# Altium schematic sheet BDS_NBIOT.SchDoc
size A2
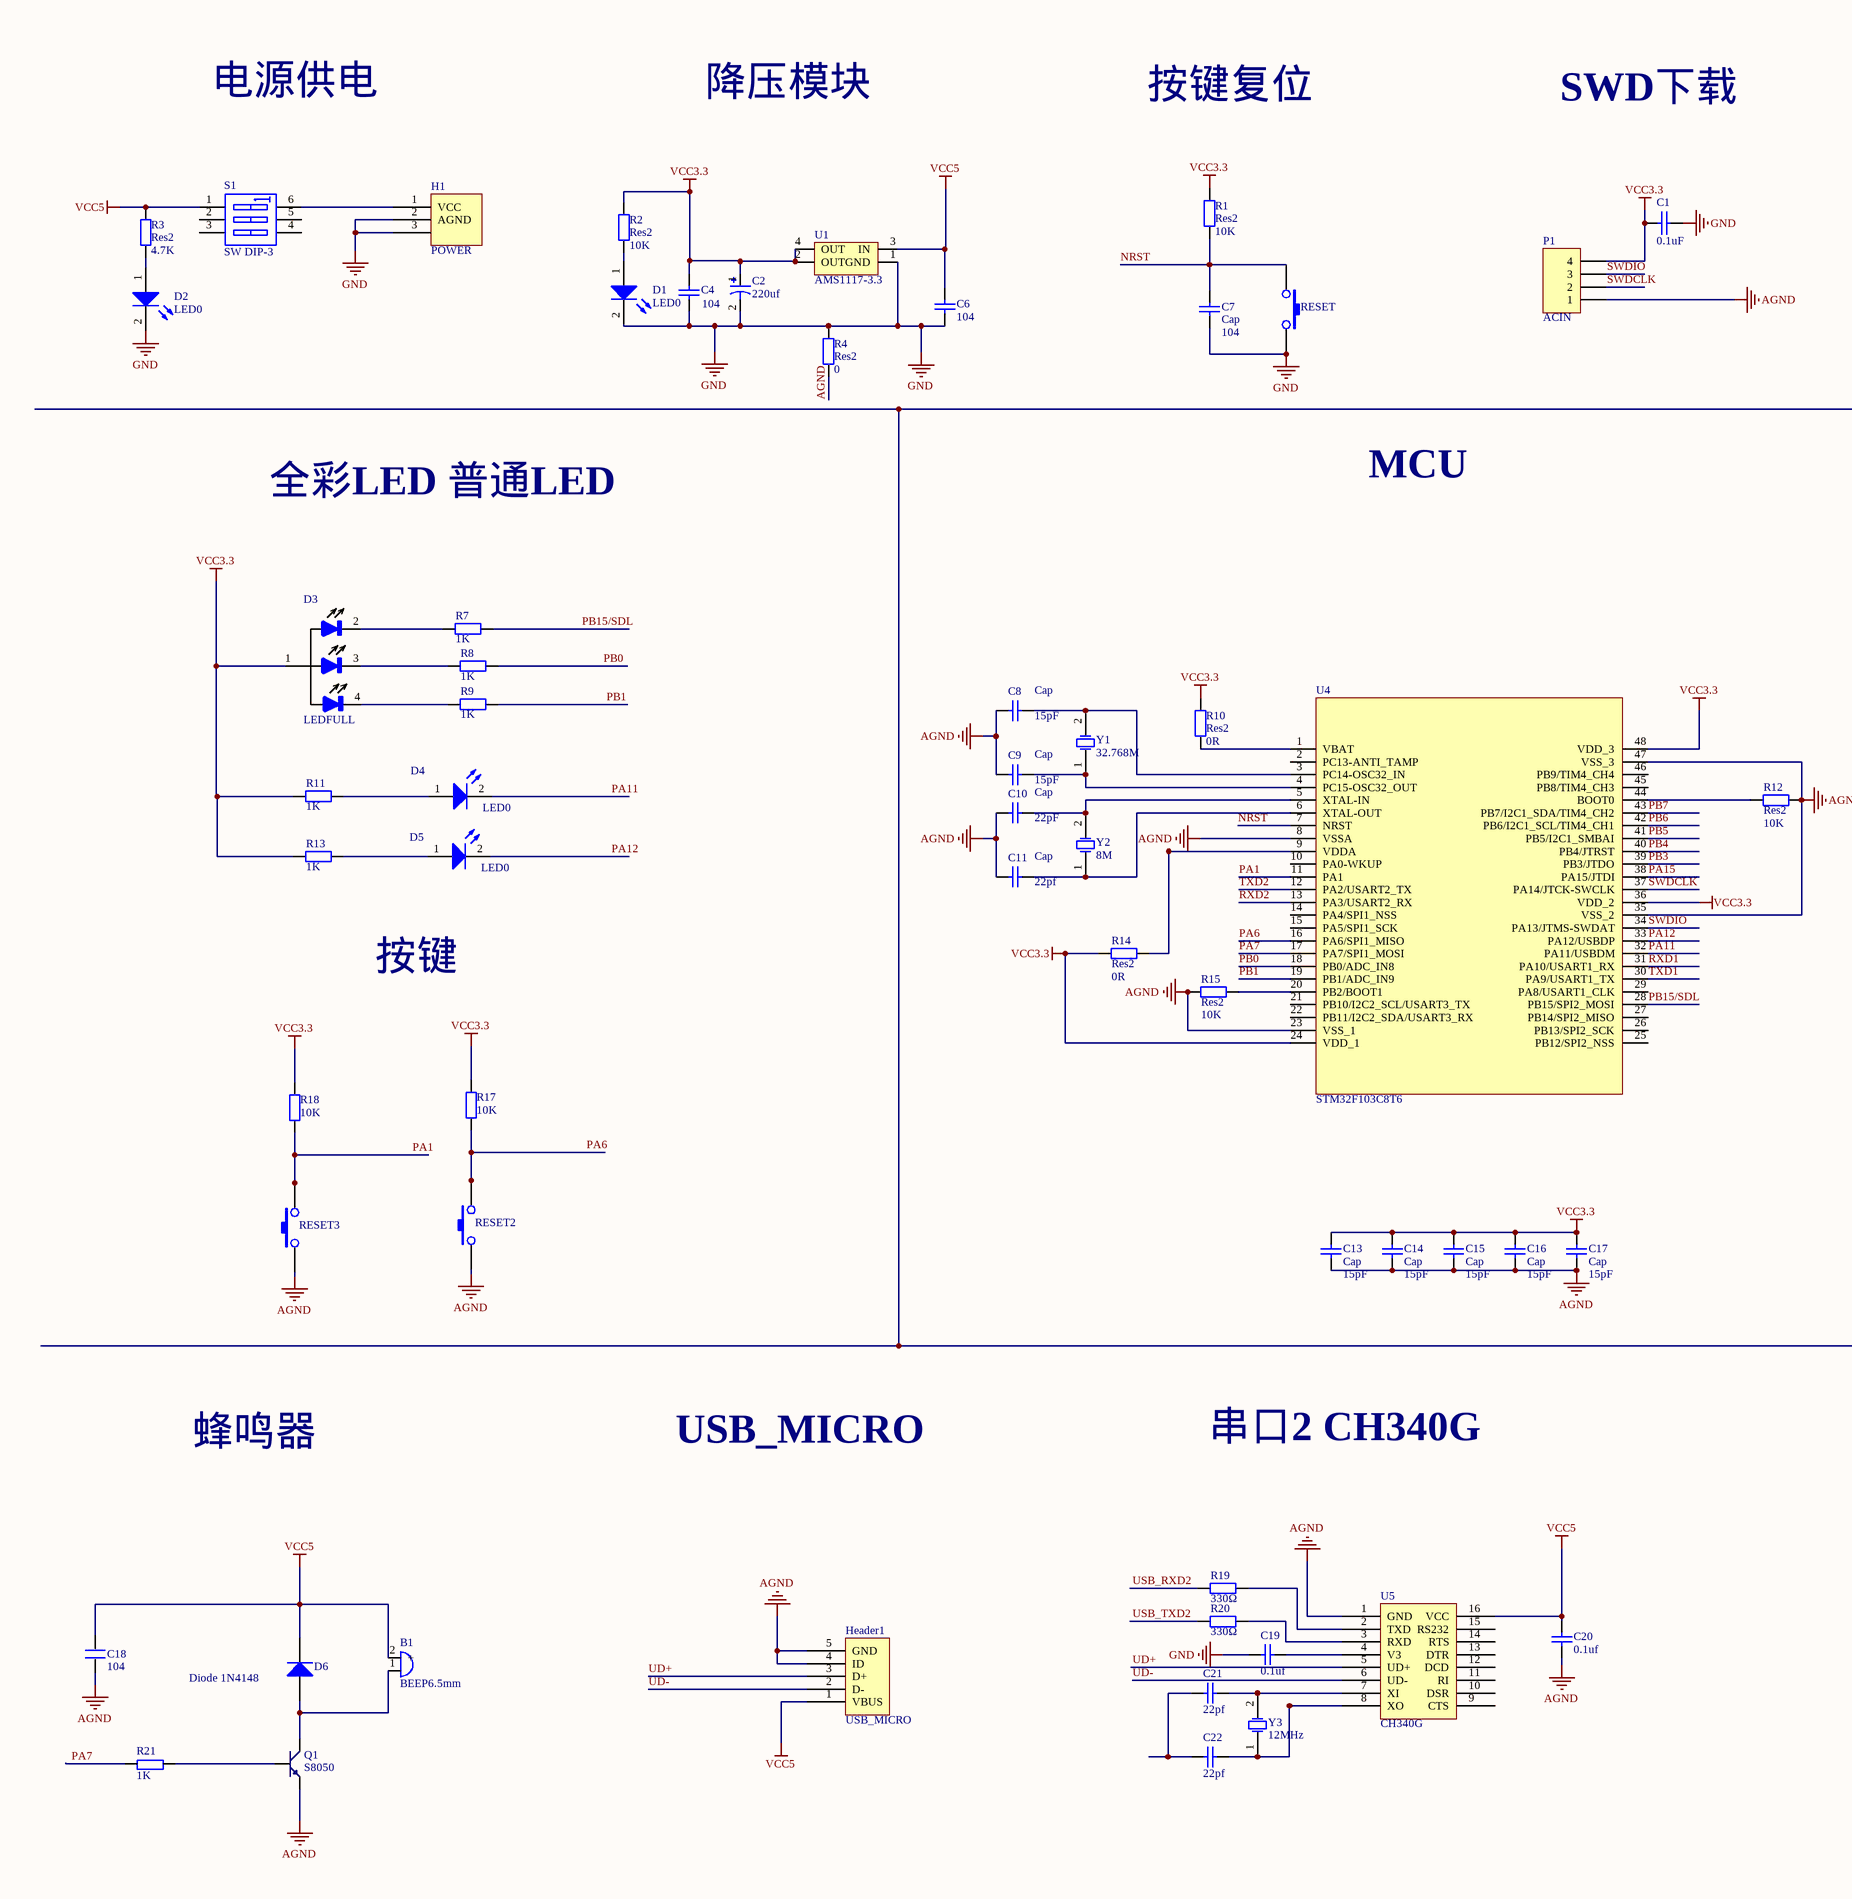
[diagram p0: BDS_NBIOT.SchDoc, left]
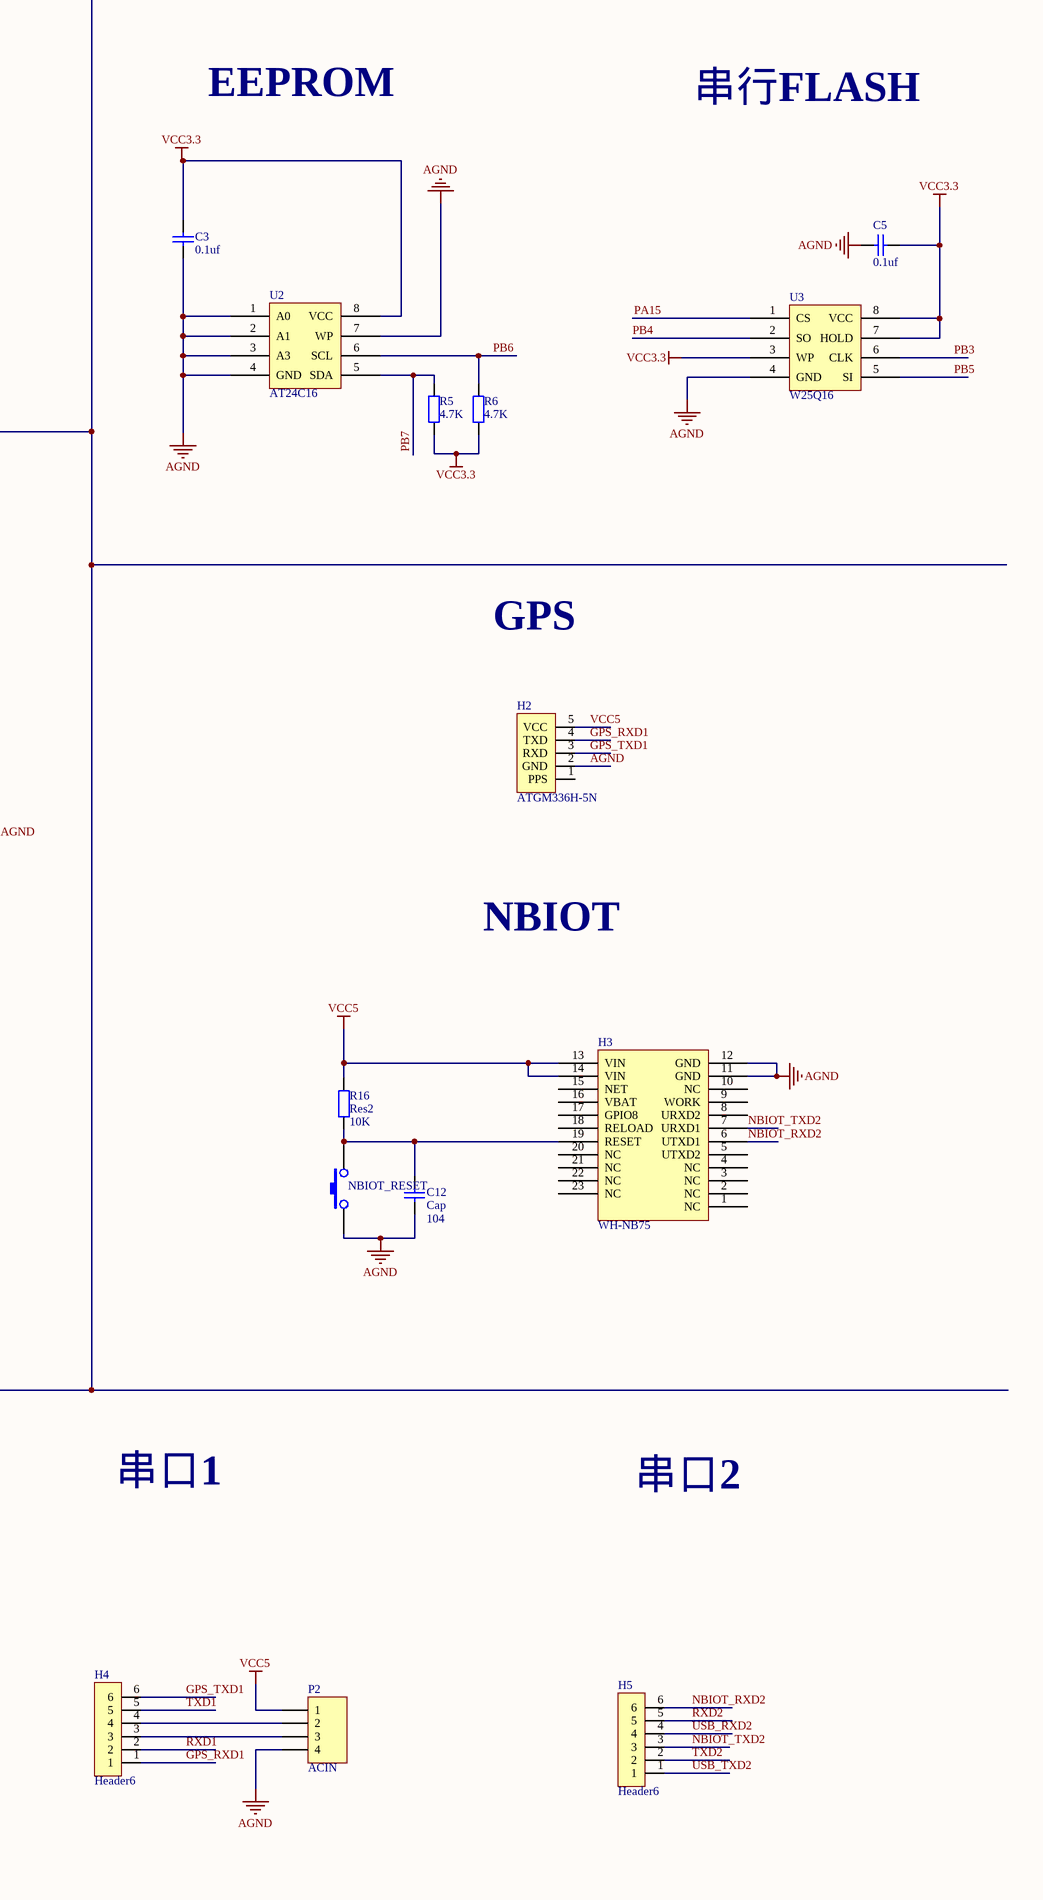
[diagram p1: BDS_NBIOT.SchDoc, right]

## Parts
B1  BEEP6.5mm  [BEEP 6.5x12x6]
C1  0.1uF  [0805C]
C2  220uf  [CAP 2.5*6.3*11.2]
C3  0.1uf  [0805C]
C4  104  [0805C]
C5  0.1uf  [0805C]
C6  104  [0805C]
C7  Cap  value 104  [0805C]
C8  Cap  value 15pF  [0805C]
C9  Cap  value 15pF  [0805C]
C10  Cap  value 22pF  [0805C]
C11  Cap  value 22pf  [0805C]
C12  Cap  value 104  [0805C]
C13  Cap  value 15pF  [0805C]
C14  Cap  value 15pF  [0805C]
C15  Cap  value 15pF  [0805C]
C16  Cap  value 15pF  [0805C]
C17  Cap  value 15pF  [0805C]
C18  104  [0805C]
C19  0.1uf  [0805C]
C20  0.1uf  [0805C]
C21  22pf  [0805C]
C22  22pf  [0805C]
D1  LED0  [0805D]
D2  LED0  [0805D]
D3  LEDFULL  [LEDFULL]
D4  LED0  [0805D]
D5  LED0  [0805D]
D6  Diode 1N4148  [0805D]
H1  POWER  [DC-005]
H2  ATGM336H-5N
H3  WH-NB75  [NBIOT]
H4  Header6  [HDR2.54-LI-6P]
H5  Header6  [HDR2.54-LI-6P]
Header1  USB_MICRO  [USB/SM0.8-6H5]
NBIOT_RESET  RESET  [KEY]  (value not drawn)
P1  ACIN  [HDR2.54-LI-4P]
P2  ACIN  [HDR2.54-LI-4P]
Q1  S8050  [SOT23-3]
R1  Res2  value 10K  [0805R]
R2  Res2  value 10K  [0805R]
R3  Res2  value 4.7K  [0805R]
R4  Res2  value 0  [0805R]
R5  4.7K  [0805R]
R6  4.7K  [0805R]
R7  1K  [0805R]
R8  1K  [0805R]
R9  1K  [0805R]
R10  Res2  value 0R  [0805R]
R11  1K  [0805R]
R12  Res2  value 10K  [0805R]
R13  1K  [0805R]
R14  Res2  value 0R  [0805R]
R15  Res2  value 10K  [0805R]
R16  Res2  value 10K  [0805R]
R17  10K  [0805R]
R18  10K  [0805R]
R19  330Ω  [0805R]
R20  330Ω  [0805R]
R21  1K  [0805R]
RESET  RESET  [KEY]  (value not drawn)
RESET2  RESET  [KEY]  (value not drawn)
RESET3  RESET  [KEY]  (value not drawn)
S1  SW DIP-3  [Switch]
U1  AMS1117-3.3  [AMS1117]
U2  AT24C16  [SOP-8]
U3  W25Q16  [SOP-8]
U4  STM32F103C8T6  [SQFP7X7-48]
U5  CH340G  [SOP16]
Y1  32.768M  [OSC HC-49SMD]
Y2  8M  [OSC HC-49SMD]
Y3  12MHz  [OSC HC-49SMD]

## Nets
AGND: C3.1 C5.1 C8.1 C9.1 C10.1 C11.1 C12.1 C13.1 C14.1 C15.1 C16.1 C17.1 C18.1 C20.1 H2.2(GND) H3.11(GND) H3.12(GND) Header1.4(ID) Header1.5(GND) NBIOT_RESET.1 P1.1 P2.4 Q1.1(E) R4.1 R12.1 R15.2 RESET2.1 RESET3.1 U2.1(A0) U2.2(A1) U2.3(A3) U2.4(GND) U2.7(WP) U3.4(GND) U4.8(VSSA) U4.23(VSS_1) U4.35(VSS_2) U4.47(VSS_3) U5.1(GND)
GND: C1.2 C2.2 C4.1 C6.1 C7.1 C19.2 D1.2(K) D2.2(K) H1.2(AGND) H1.3 R4.2 RESET.2 U1.1(GND)
VCC3.3: C1.1 C2.1 C3.2 C4.2 C5.2 C13.2 C14.2 C15.2 C16.2 C17.2 D3.1 P1.4 R1.2 R2.2 R5.1 R6.1 R10.2 R11.1 R13.1 R14.2 R17.1 R18.1 U1.2(OUT) U1.4(OUT) U2.8(VCC) U3.3(WP) U3.7(HOLD) U3.8(VCC) U4.24(VDD_1) U4.36(VDD_2) U4.48(VDD_3)
VCC5: B1.2(+) C6.2 C18.2 C20.2 D6.2(K) H2.5(VCC) H3.13(VIN) H3.14(VIN) Header1.1(VBUS) P2.1 R3.2 R16.2 S1.1(A1) U1.3(IN) U5.16(VCC)
GPS_RXD1: H2.4(TXD) H4.1
GPS_TXD1: H2.3(RXD) H4.6
NBIOT_RXD2: H3.6(UTXD1) H5.6
NBIOT_TXD2: H3.7(URXD1) H5.3
NRST: C7.2 R1.1 RESET.1 U4.7(NRST)
PA1: R18.2 RESET3.2 U4.11(PA1)
PA6: R17.2 RESET2.2 U4.16(PA6/SPI1_MISO)
PA7: R21.1 U4.17(PA7/SPI1_MOSI)
PA11: D4.2(K) U4.32(PA11/USBDM)
PA12: D5.2(K) U4.33(PA12/USBDP)
PA15: U3.1(CS) U4.38(PA15/JTDI)
PB0: R8.2 U4.18(PB0/ADC_IN8)
PB1: R9.2 U4.19(PB1/ADC_IN9)
PB3: U3.6(CLK) U4.39(PB3/JTDO)
PB4: U3.2(SO) U4.40(PB4/JTRST)
PB5: U3.5(SI) U4.41(PB5/I2C1_SMBAI)
PB6: R6.2 U2.6(SCL) U4.42(PB6/I2C1_SCL/TIM4_CH1)
PB7: R5.2 U2.5(SDA) U4.43(PB7/I2C1_SDA/TIM4_CH2)
PB15/SDL: R7.2 U4.28(PB15/SPI2_MOSI)
RXD1: H4.2 U4.31(PA10/USART1_RX)
RXD2: H5.5 U4.13(PA3/USART2_RX)
SWDCLK: P1.2 U4.37(PA14/JTCK-SWCLK)
SWDIO: P1.3 U4.34(PA13/JTMS-SWDAT)
TXD1: H4.5 U4.30(PA9/USART1_TX)
TXD2: H5.2 U4.12(PA2/USART2_TX)
UD+: Header1.3(D+) U5.5(UD+)
UD-: Header1.2(D-) U5.6(UD-)
USB_RXD2: H5.4 R19.1
USB_TXD2: H5.1 R20.1
NetB1_1: B1.1 D6.1(A) Q1.3(C)
NetC8_2: C8.2 U4.3(PC14-OSC32_IN) Y1.2(OSC2)
NetC9_2: C9.2 U4.4(PC15-OSC32_OUT) Y1.1(OSC1)
NetC10_2: C10.2 U4.5(XTAL-IN) Y2.2(OSC2)
NetC11_2: C11.2 U4.6(XTAL-OUT) Y2.1(OSC1)
NetC12_2: C12.2 H3.19(RESET) NBIOT_RESET.2 R16.1
NetC19_1: C19.1 U5.4(V3)
NetC21_1: C21.1 U5.7(XI) Y3.2(OSC2)
NetC21_2: C21.2 C22.2
NetC22_1: C22.1 U5.8(XO) Y3.1(OSC1)
NetD1_1: D1.1(A) R2.1
NetD2_1: D2.1(A) R3.1
NetD3_2: D3.2 R7.1
NetD3_3: D3.3 R8.1
NetD3_4: D3.4 R9.1
NetD4_1: D4.1(A) R11.2
NetD5_1: D5.1(A) R13.2
NetH1_1: H1.1(VCC) S1.6(B1)
NetH4_3: H4.3 P2.3
NetH4_4: H4.4 P2.2
NetQ1_2: Q1.2(B) R21.2
NetR10_1: R10.1 U4.1(VBAT)
NetR12_2: R12.2 U4.44(BOOT0)
NetR14_1: R14.1 U4.9(VDDA)
NetR15_1: R15.1 U4.20(PB2/BOOT1)
NetR19_2: R19.2 U5.2(TXD)
NetR20_2: R20.2 U5.3(RXD)

Not connected (* = marked no-connect by the designer): H2 1(PPS); H3 1(NC) 2(NC) 3(NC) 4(NC) 5(UTXD2) 8(URXD2) 9(WORK) 10(NC) 15(NET) 16(VBAT) 17(GPIO8) 18(RELOAD) 20(NC) 21(NC) 22(NC) 23(NC); S1 2(A2) 3(A3) 4(B3) 5(B2); U4 2(PC13-ANTI_TAMP) 10(PA0-WKUP) 14(PA4/SPI1_NSS) 15(PA5/SPI1_SCK) 21(PB10/I2C2_SCL/USART3_TX) 22(PB11/I2C2_SDA/USART3_RX) 25(PB12/SPI2_NSS) 26(PB13/SPI2_SCK) 27(PB14/SPI2_MISO) 29(PA8/USART1_CLK) 45(PB8/TIM4_CH3) 46(PB9/TIM4_CH4); U5 9(CTS) 10(DSR) 11(RI) 12(DCD) 13(DTR) 14(RTS) 15(RS232)

## Notes on the sheet
- 电源供电
- 降压模块
- 按键复位
- SWD下载
- EEPROM
- 串行FLASH
- MCU
- 全彩LED 普通LED
- GPS
- NBIOT
- 按键
- 蜂鸣器
- USB_MICRO
- 串口2 CH340G
- 串口1
- 串口2

## Library data of the parts
B1 = BEEP
C1 = CAP: Capacitor
C2 = Cap Pol3: Polarized Capacitor (Surface Mount); Published: 8-Jun-2000; LatestRevisionDate: 29-May-2009; LatestRevisionNote: IPC-7351 Footprint Added.; PackageReference: C0805; Publisher: Altium Limited; PackageDescription: Chip Capacitor; Value: 220uf
C3-C17 C19 C20 = Cap: Capacitor; Published: 8-Jun-2000; LatestRevisionDate: 17-Jul-2002; LatestRevisionNote: Re-released for DXP Platform.; PackageReference: RAD-0.3; Publisher: Altium Limited; PackageDescription: Radial Cap, Thru-Hole; 2 Leads; 0.3 in Pin Spacing
  C3 C5 C19 C20: Value: 0.1uf
  C4 C6: Value: 104
C18 = C
C21 C22 = Cap: Capacitor; Value: 0.1uf; Published: 8-Jun-2000; LatestRevisionDate: 17-Jul-2002; LatestRevisionNote: Re-released for DXP Platform.; PackageReference: RAD-0.3; Publisher: Altium Limited; PackageDescription: Radial Cap, Thru-Hole; 2 Leads; 0.3 in Pin Spacing
D1 D2 D4 D5 = LED0: Typical INFRARED GaAs LED; Published: 8-Jun-2000; LatestRevisionDate: 08-Jul-2005; LatestRevisionNote: Mech Layer 1 removed.; PackageReference: LED-0; Publisher: Altium Limited; PackageDescription: LED; 2 Leads
D3 = LEDFULL: 全彩LED
D6 = Diode 1N4148: High Conductance Fast Diode; Published: 8-Jun-2000; LatestRevisionDate: 17-Jul-2002; LatestRevisionNote: Re-released for DXP Platform.; DatasheetVersion: 1997; PackageReference: DO-35; Publisher: Altium Limited; PackageDescription: Diode, Axial; Body 3.8 x 1.9 mm (LxDia. max), Lead Dia. 0.53 mm (max); Code_JEDEC: DO-204-AH; ComponentLink1Description: Manufacturer Link; ComponentLink1URL: http://www.fairchildsemi.com/; ComponentLink2Description: Datasheet; ComponentLink2URL: http://www.fairchildsemi.com/ds/1N%2F1N4148.pdf
H1 = DC_IN
H2 = ATGM336H-5N: GPS
H3 = WH-NB75: NBIOT模块
H4 H5 = Header6: 6P接线
NBIOT_RESET RESET RESET2 RESET3 = SW-PB
P1 P2 = P4: Header, 4-Pin; LatestRevisionDate: 17-Jul-2002; LatestRevisionNote: Re-released for DXP Platform.; Publisher: Altium Limited
Q1 = NPN: 8050/BCW846/BCW847
R1-R4 R10 R12 R14-R16 = Res2: Resistor; Published: 8-Jun-2000; LatestRevisionDate: 17-Jul-2002; LatestRevisionNote: Re-released for DXP Platform.; PackageReference: AXIAL-0.4; Publisher: Altium Limited; PackageDescription: Axial Device, Thru-Hole; 2 Leads; 0.4 in Pin Spacing
R5-R9 R11 R13 R17-R20 = Res2: Resistor; Manufacturer: Generic Components; Class: Passive; Value: 330; Published: 08/06/2000; Publisher: Altium Hobart Technology Centre; SubClass: Resistor
R21 = R_1
S1 = SW DIP-3: DIP Switch, 3 Position, SPST; Published: 24-Mar-1999; LatestRevisionDate: 17-Jul-2002; LatestRevisionNote: Re-released for DXP Platform.; PackageReference: DIP-6; Publisher: Altium Limited; Code_JEDEC: MO-001-AM
U2 = AT24C16: EEPROM
U3 = W25Q16: 串行FLASH
Y1-Y3 = XTAL: Crystal Oscillator; Published: 8-Jun-2000; LatestRevisionDate: 17-Jul-2002; LatestRevisionNote: Re-released for DXP Platform.; Publisher: Altium Limited
  Y1 Y2: PackageReference: R38; PackageDescription: Crystal, Thru-Hole; 2 Leads; Body 3.1 x 8.2 mm (Dia.xH)